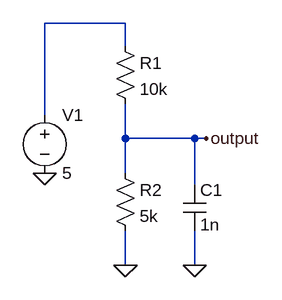
[diagram p0: schematic Draft21.asc]
Draft21.asc, the LTspice schematic file:
Version 4.1
SHEET 1 880 680
WIRE 176 16 64 16
WIRE 176 48 176 16
WIRE 64 144 64 16
WIRE 176 176 176 128
WIRE 272 176 176 176
WIRE 288 176 272 176
WIRE 176 224 176 176
WIRE 272 240 272 176
WIRE 176 352 176 304
WIRE 272 352 272 304
FLAG 64 224 0
FLAG 176 352 0
FLAG 288 176 output
FLAG 272 352 0
SYMBOL res 160 32 R0
SYMATTR InstName R1
SYMATTR Value 10k
SYMBOL res 160 208 R0
SYMATTR InstName R2
SYMATTR Value 5k
SYMBOL voltage 64 128 R0
WINDOW 123 0 0 Left 0
WINDOW 39 0 0 Left 0
SYMATTR InstName V1
SYMATTR Value 5
SYMBOL cap 256 240 R0
SYMATTR InstName C1
SYMATTR Value 1n

The netlist it stands for:
* Draft21.asc
R1 N001 output 10k
R2 output 0 5k
V1 N001 0 5
C1 output 0 1n
.backanno
.end